# EAGLE design BluePill Breakout v0 (EAGLE 9.5.0)
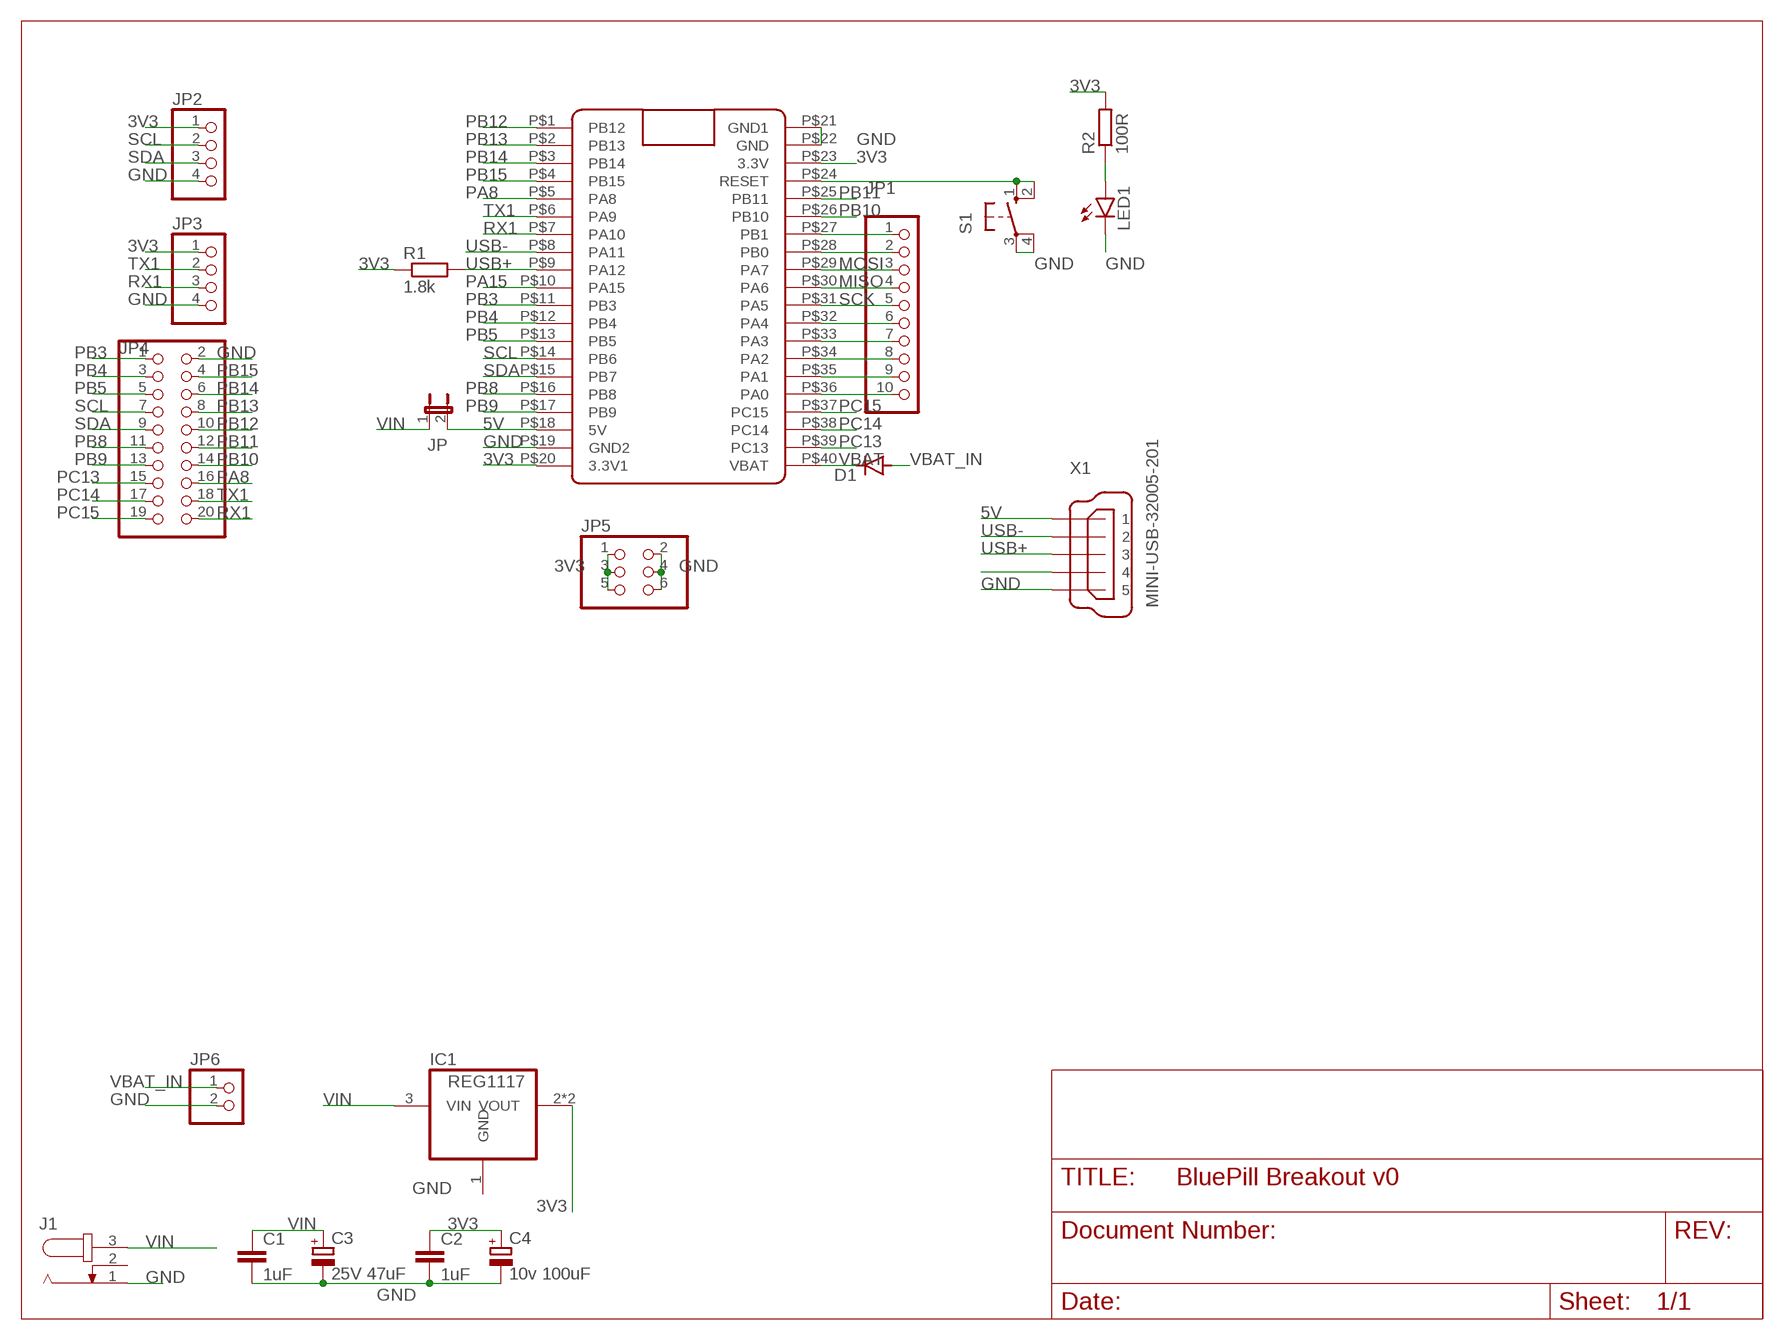
[diagram p0: schematic, sheet 1]

## Parts
C1  1uF  C-EUC0603  [C0603]
C2  1uF  C-EUC0603  [C0603]
C3  25V 47uF  CPOL-EUE2.5-5  [E2,5-5]
C4  10v 100uF  CPOL-EUE2.5-5  [E2,5-5]
D1  DIODE-DO-214AC  [DO-214AC]
IC1  REG1117  [SOT223]
J1  JACK-PLUG0  [SPC4077]
JP  JP1E  [JP1]
JP1  PINHD-1X10  [1X10]
JP2  PINHD-1X4  [1X04]
JP3  PINHD-1X4  [1X04]
JP4  PINHD-2X10  [2X10]
JP5  PINHD-2X3  [2X03]
JP6  PINHD-1X2  [1X02]
LED1  LEDCHIPLED_0603  [CHIPLED_0603]
R1  1.8k  R-EU_R0603  [R0603]
R2  100R  R-EU_R0603  [R0603]
S1  10-XX  [B3F-10XX]
U$1  BLUE_PILL  [BLUE_PILL]
X1  MINI-USB-32005-201  [32005-201]

## Nets
3V3: C2.1 C4.+ IC1.2(VOUT) IC1.4(VOUT) JP2.1 JP3.1 JP5.1 JP5.3 JP5.5 R1.1 R2.2 U$1.P$20(3.3V1) U$1.P$23(3.3V)
5V: JP.2 U$1.P$18(5V) X1.1
GND: C1.2 C2.2 C3.- C4.- J1.1 JP2.4 JP3.4 JP4.2 JP5.2 JP5.4 JP5.6 JP6.2 LED1.C S1.3(P) S1.4(P1) U$1.P$19(GND2) U$1.P$21(GND1) U$1.P$22(GND) X1.5
MISO: JP1.4 U$1.P$30(PA6)
MOSI: JP1.3 U$1.P$29(PA7)
N$3: JP1.10 U$1.P$36(PA0)
N$4: JP1.9 U$1.P$35(PA1)
N$5: JP1.8 U$1.P$34(PA2)
N$6: JP1.7 U$1.P$33(PA3)
N$7: JP1.6 U$1.P$32(PA4)
N$8: S1.1(S) S1.2(S1) U$1.P$24(RESET)
N$9: LED1.A R2.1
N$11: JP1.1 U$1.P$27(PB1)
N$12: JP1.2 U$1.P$28(PB0)
N$15: X1.4
PA8: JP4.16 U$1.P$5(PA8)
PA15: U$1.P$10(PA15)
PB3: JP4.1 U$1.P$11(PB3)
PB4: JP4.3 U$1.P$12(PB4)
PB5: JP4.5 U$1.P$13(PB5)
PB8: JP4.11 U$1.P$16(PB8)
PB9: JP4.13 U$1.P$17(PB9)
PB10: JP4.14 U$1.P$26(PB10)
PB11: JP4.12 U$1.P$25(PB11)
PB12: JP4.10 U$1.P$1(PB12)
PB13: JP4.8 U$1.P$2(PB13)
PB14: JP4.6 U$1.P$3(PB14)
PB15: JP4.4 U$1.P$4(PB15)
PC13: JP4.15 U$1.P$39(PC13)
PC14: JP4.17 U$1.P$38(PC14)
PC15: JP4.19 U$1.P$37(PC15)
RX1: JP3.3 JP4.20 U$1.P$7(PA10)
SCK: JP1.5 U$1.P$31(PA5)
SCL: JP2.2 JP4.7 U$1.P$14(PB6)
SDA: JP2.3 JP4.9 U$1.P$15(PB7)
TX1: JP3.2 JP4.18 U$1.P$6(PA9)
USB+: R1.2 U$1.P$9(PA12) X1.3
USB-: U$1.P$8(PA11) X1.2
VBAT: D1.C U$1.P$40(VBAT)
VBAT_IN: D1.A JP6.1
VIN: C1.1 C3.+ IC1.3(VIN) J1.3 JP.1
Unconnected: J1.2

## Power pins joined to a net without a drawn wire
GND: IC1.1(GND)

## Library data of the parts
C1 C2 = rcl:C-EU: CAPACITOR, European symbol; SPICEPREFIX: C
C3 C4 = rcl:CPOL-EU: POLARIZED CAPACITOR, European symbol; SPICEPREFIX: C
D1 = diode:DIODE-: DIODE
IC1 = Whizz:REG1117: 800mA and 1A Low Dropout (LDO) Positive Regulator 1.8V, 2.5V, 2.85V, 3.3V, 5V, and Adj; MPN: REG1117; OC_FARNELL: 1097566; OC_NEWARK: 14P6981
J1 = con-jack:JACK-PLUG: DC POWER JACK Power Jack, DC, Right Angle, Through Hole, Rated 5A at 16VDC, PC Terminals Distributor: Farnell (www.Farnell.de) Drawing: 84N1161.pdf / 84N1162.pdf Manufacturer: SPC Technology (www.spctechnology.com) Type: SPC4077 / SPC 4078; OC_FARNELL: unknown; OC_NEWARK: unknown
JP = jumper:JP1E: JUMPER
JP1 = pinhead:PINHD-1X10: PIN HEADER
JP2 JP3 = pinhead:PINHD-1X4: PIN HEADER
JP4 = pinhead:PINHD-2X10: PIN HEADER
JP5 = pinhead:PINHD-2X3: PIN HEADER
JP6 = pinhead:PINHD-1X2: PIN HEADER
LED1 = led:LED: LED OSRAM: - CHIPLED LG R971, LG N971, LY N971, LG Q971, LY Q971, LO R971, LY R971 LH N974, LH R974 LS Q976, LO Q976, LY Q976 LO Q996 - Hyper CHIPLED LW Q18S LB Q993, LB Q99A, LB R99A - SideLED LS A670, LO A670, LY A670, LG A670, LP A670 LB A673, LV A673, LT A673, LW A673 LH A674 LY A675 LS A676, LA A676, LO A676, LY A676, LW A676 LS A679, LY A679, LG A679 - Hyper Micro SIDELED® LS Y876, LA Y876, LO Y876, LY Y876 LT Y87S - SmartLED LW L88C, LW L88S LB L89C, LB L89S, LG L890 LS L89K, LO L89K, LY L89K LS L896, LA L896, LO L896, LY L896 - TOPLED LS T670, LO T670, LY T670, LG T670, LP T670 LSG T670, LSP T670, LSY T670, LOP T670, LYG T670 LG T671, LOG T671, LSG T671 LB T673, LV T673, LT T673, LW T673 LH T674 LS T676, LA T676, LO T676, LY T676, LB T676, LH T676, LSB T676, LW T676 LB T67C, LV T67C, LT T67C, LS T67K, LO T67K, LY T67K, LW E67C LS E67B, LA E67B, LO E67B, LY E67B, LB E67C, LV E67C, LT E67C LW T67C LS T679, LY T679, LG T679 LS T770, LO T770, LY T770, LG T770, LP T770 LB T773, LV T773, LT T773, LW T773 LH T774 LS E675, LA E675, LY E675, LS T675 LS T776, LA T776, LO T776, LY T776, LB T776 LHGB T686 LT T68C, LB T68C - Hyper Mini TOPLED® LB M676 - Mini TOPLED Santana® LG M470 LS M47K, LO M47K, LY M47K Source: http://www.osram.convergy.de LUXEON: - LUMILED® LXK2-PW12-R00, LXK2-PW12-S00, LXK2-PW14-U00, LXK2-PW14-V00 LXK2-PM12-R00, LXK2-PM12-S00, LXK2-PM14-U00 LXK2-PE12-Q00, LXK2-PE12-R00, LXK2-PE12-S00, LXK2-PE14-T00, LXK2-PE14-U00 LXK2-PB12-K00, LXK2-PB12-L00, LXK2-PB12-M00, LXK2-PB14-N00, LXK2-PB14-P00, LXK2-PB14-Q00 LXK2-PR12-L00, LXK2-PR12-M00, LXK2-PR14-Q00, LXK2-PR14-R00 LXK2-PD12-Q00, LXK2-PD12-R00, LXK2-PD12-S00 LXK2-PH12-R00, LXK2-PH12-S00 LXK2-PL12-P00, LXK2-PL12-Q00, LXK2-PL12-R00 Source: www.luxeon.com KINGBRIGHT: KA-3528ASYC Source: www.kingbright.com
R1 R2 = rcl:R-EU_: RESISTOR, European symbol; SPICEPREFIX: R
S1 = switch-omron:10-XX: OMRON SWITCH; MPN: B3F-1000; OC_FARNELL: 176432; OC_NEWARK: 36M3542
U$1 = Whizz:BLUE_PILL
X1 = con-cypressindustries:MINI-USB-: MINI USB-B Conector Source: www.cypressindustries.com; OC_FARNELL: unknown; OC_NEWARK: unknown

## Board
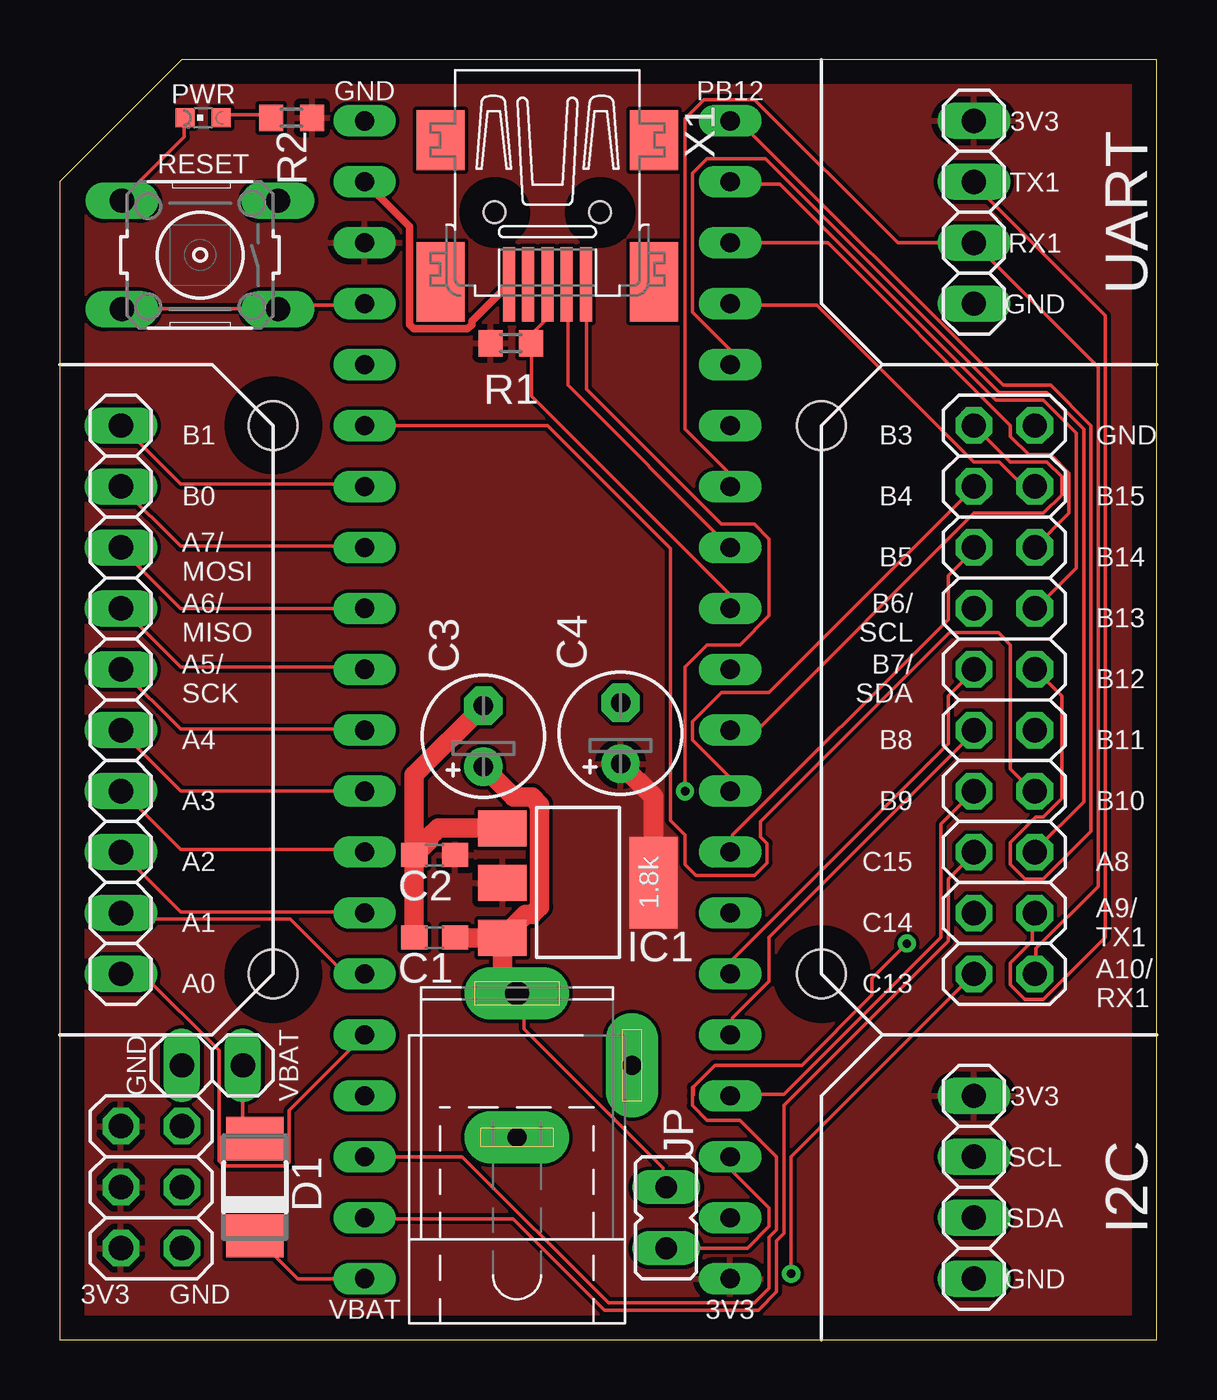
[diagram p1: board, top side]
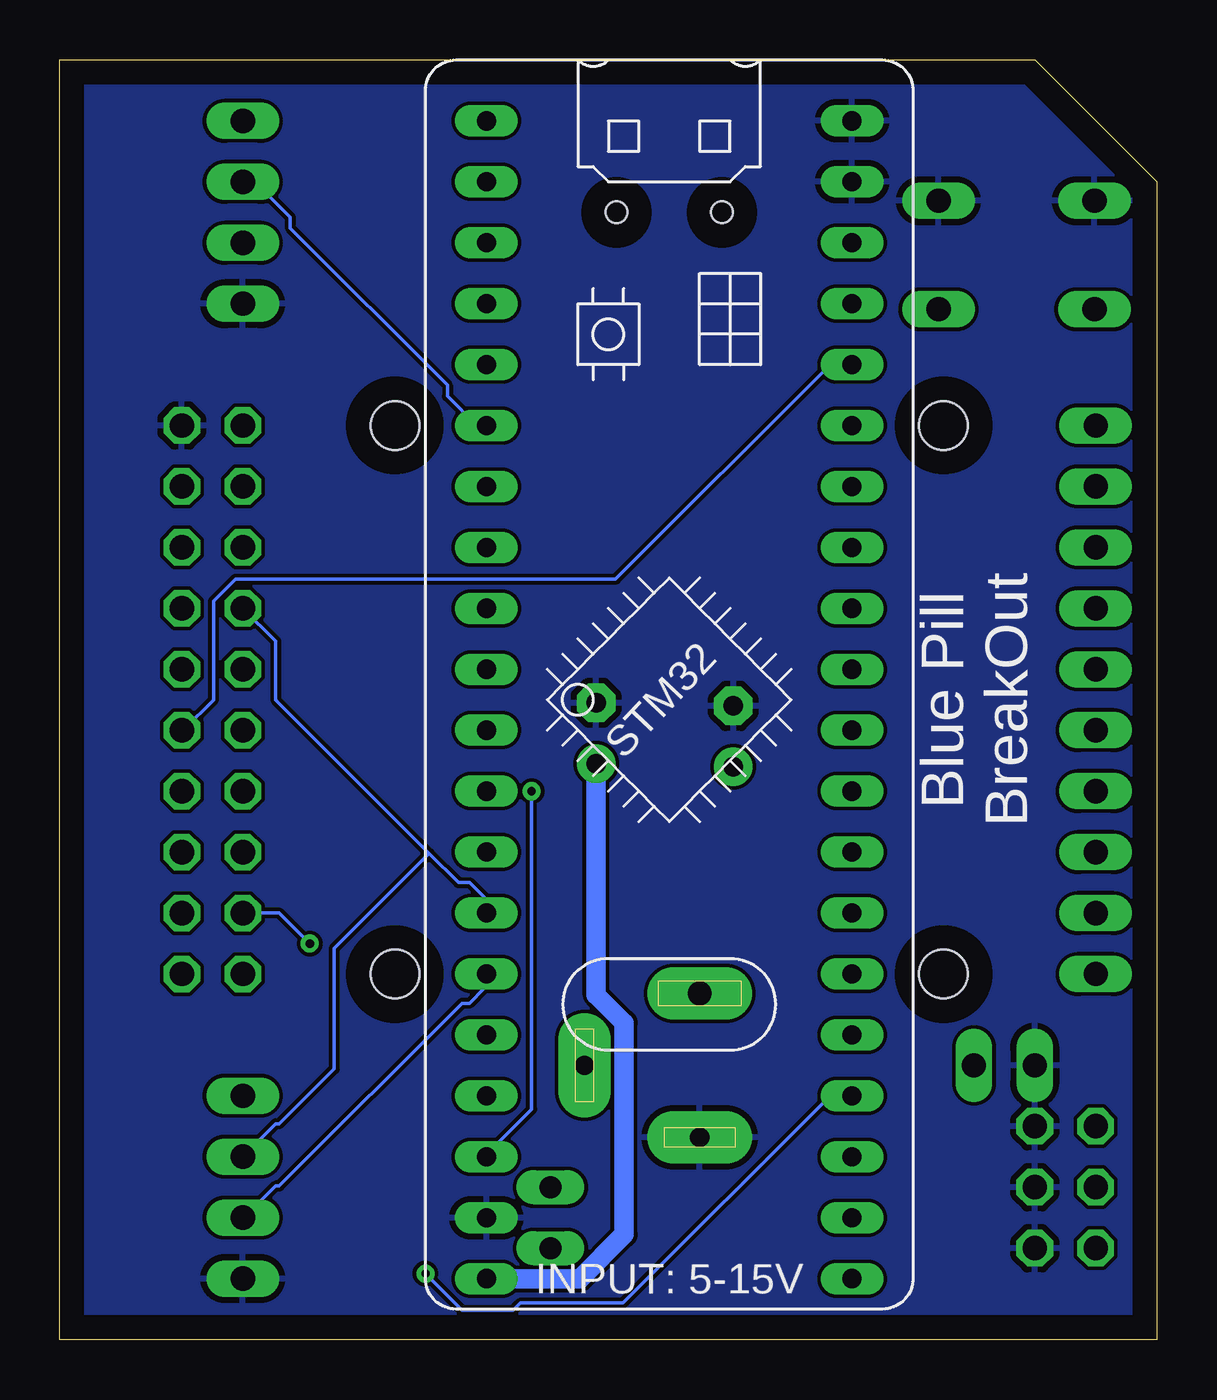
[diagram p2: board, bottom side, seen from below]

Size 45.72 x 53.34 mm. Coordinates in mm from the lower left corner, seen from the top.
Outline: 0,0 45.72,0 45.72,53.34 5.08,53.34 0,48.26 0,0
Copper layers (1*16): Top 0.035mm / dielectric 1.5mm / Bottom 0.035mm
Design rules "default": minimum track width 6mil, minimum drill 0.35mm, track to track 6mil, track to pad 6mil, pad to pad 6mil, via to via 6mil, smd to smd 6mil, copper to edge 40mil, drill to drill 6mil, minimum pad ring 10mil, minimum via ring 8mil, stop-mask expansion 4mil, vias tented up to drill 0mil, thermal gap 10mil
Holes 2.03 mm at 31.75,15.24 8.89,15.24 8.89,38.1 31.75,38.1

### Footprints (pad centres in the part's own frame; a part is rotated, then mirrored left to right if it is on the bottom)
C0603 = smd 1.1 x 1: 1 -0.85,0; 2 0.85,0
E2,5-5 = drill 0.813 pad 1.6: + -1.27,0 | drill 0.813 pad 1.6 octagon: - 1.27,0
DO-214AC = smd 1.8 x 2.4: A 2.025,0; C -2.025,0
SOT223 = smd 1.499 x 2.007: 1 -2.261,-3.15; 2 0.025,-3.15; 3 2.311,-3.15 | smd 3.81 x 2.007: 4 0,3.15
SPC4077 = drill 0.8 pad 2.184 long: 1 -3,0; 2 0,-4.8 | drill 1 pad 2.184 long: 3 3,0
JP1 = drill 0.914 long: 1 0,-1.27; 2 0,1.27
1X10 = drill 1.016 long: 1 -11.43,0; 2 -8.89,0; 3 -6.35,0; 4 -3.81,0; 5 -1.27,0; 6 1.27,0; 7 3.81,0; 8 6.35,0; 9 8.89,0; 10 11.43,0
1X04 = drill 1.016 long: 1 -3.81,0; 2 -1.27,0; 3 1.27,0; 4 3.81,0
2X10 = drill 1.016 octagon: 1 -11.43,-1.27; 2 -11.43,1.27; 3 -8.89,-1.27; 4 -8.89,1.27; 5 -6.35,-1.27; 6 -6.35,1.27; 7 -3.81,-1.27; 8 -3.81,1.27; 9 -1.27,-1.27; 10 -1.27,1.27; 11 1.27,-1.27; 12 1.27,1.27; 13 3.81,-1.27; 14 3.81,1.27; 15 6.35,-1.27; 16 6.35,1.27; 17 8.89,-1.27; 18 8.89,1.27; 19 11.43,-1.27; 20 11.43,1.27
2X03 = drill 1.016 octagon: 1 -2.54,-1.27; 2 -2.54,1.27; 3 0,-1.27; 4 0,1.27; 5 2.54,-1.27; 6 2.54,1.27
1X02 = drill 1.016 long: 1 -1.27,0; 2 1.27,0
CHIPLED_0603 = smd 0.8 x 0.8: A 0,-0.75; C 0,0.75
R0603 = smd 1 x 1.1: 1 -0.85,0; 2 0.85,0
B3F-10XX = drill 1.016 long: 1 -3.251,2.261; 2 3.251,2.261; 3 -3.251,-2.261; 4 3.251,-2.261
BLUE_PILL = drill 0.8 long: P$1 -7.62,15.24; P$2 -7.62,12.7; P$3 -7.62,10.16; P$4 -7.62,7.62; P$5 -7.62,5.08; P$6 -7.62,2.54; P$7 -7.62,0; P$8 -7.62,-2.54; P$9 -7.62,-5.08; P$10 -7.62,-7.62; P$11 -7.62,-10.16; P$12 -7.62,-12.7; P$13 -7.62,-15.24; P$14 -7.62,-17.78; P$15 -7.62,-20.32; P$16 -7.62,-22.86; P$17 -7.62,-25.4; P$18 -7.62,-27.94; P$19 -7.62,-30.48; P$20 -7.62,-33.02; P$21 7.62,15.24; P$22 7.62,12.7; P$23 7.62,10.16; P$24 7.62,7.62; P$25 7.62,5.08; P$26 7.62,2.54; P$27 7.62,0; P$28 7.62,-2.54; P$29 7.62,-5.08; P$30 7.62,-7.62; P$31 7.62,-10.16; P$32 7.62,-12.7; P$33 7.62,-15.24; P$34 7.62,-17.78; P$35 7.62,-20.32; P$36 7.62,-22.86; P$37 7.62,-25.4; P$38 7.62,-27.94; P$39 7.62,-30.48; P$40 7.62,-33.02
32005-201 = smd 3.1 x 0.5: 1 3,1.6; 2 3,0.8; 3 3,0; 4 3,-0.8; 5 3,-1.6 | smd 2.5 x 2: M1 -3,-4.45; M2 -3,4.45 | smd 3.3 x 2: M3 2.9,4.45; M4 2.9,-4.45 | hole 0.9: 0,2.2; 0,-2.2

### Placement (x,y rotation side)
C1  15.62,16.76 180 top
C2  15.62,20.19 180 top
C3  17.65,25.15 90 top
C4  23.37,25.27 90 top
D1  8.13,6.35 90 top
IC1  21.59,19.05 270 top
J1  19.05,11.43 90 top
JP  25.27,5.08 180 top
JP1  2.54,26.67 270 top
JP2  38.1,6.35 270 top
JP3  38.1,46.99 270 top
JP4  39.37,26.67 270 top
JP5  3.81,6.35 270 top
JP6  6.35,11.43 180 top
LED1  5.97,50.93 90 top
R1  18.8,41.53 0 top
R2  9.65,50.93 0 top
S1  5.84,45.21 180 top
U$1  20.32,35.56 0 bottom
X1  20.32,46.99 270 top

### Tracks (layer width: path | path; a pad name or v marks a point on that pad's centre or on a via)
3V3
  Top 0.813: C4.+ 24.74,22.63 IC1.4
  Bottom 0.305: 38.1,9.89 JP2.1
  Bottom 0.813: C4.+ 23.37,14.38 22.2,13.21 22.2,4.38 24.04,2.54 U$1.P$20
  pour Top (rank 6): 0,53.34 0,0 45.72,0 45.72,53.34
  pour Top (no thermals): 26.67,16.51 22.86,16.51 22.86,21.59 26.67,21.59
5V  (via drill 0.35)
  Top 0.152: JP.2 28.65,3.81 29.57,4.72 29.57,5.49 28.04,7.01 28.04,7.62 U$1.P$18 | v26.06,22.86 26.06,28.04 26.98,28.96 28.35,28.96 29.57,30.18 29.57,33.38 28.96,33.98 27.58,33.98 21.95,39.62 21.95,43.89 X1.1
  Bottom 0.152: v26.06,22.86 26.06,9.6 28.04,7.62 U$1.P$18
GND
  Top 0.152: LED1.C 5.18,50.9 5.18,50.14 2.59,47.55 S1.4 | 17.78,21.34 18.44,21.34 IC1.1
  Top 0.305: X1.5 17.18,42.45 17.18,42.31 17,42.13 14.74,42.13 14.56,42.31 14.56,46.4 U$1.P$22
  Top 0.813: C3.- 14.77,23.53 C2.2 | C1.2 C2.2 | C2.2 15.36,20.78 15.36,20.92 15.77,21.34 17.78,21.34
  pour Bottom: 0,53.34 45.72,53.34 45.72,0 0,0
MISO
  Top 0.152: U$1.P$30 12.65,28.04 5.03,28.04 2.59,30.48 JP1.4
MOSI
  Top 0.152: U$1.P$29 5.03,30.48 2.59,32.92 JP1.3
N$3
  Top 0.152: 12.65,12.8 U$1.P$36 9.56,9.56 9.56,7.38 9.42,7.25 6.83,7.25 6.63,7.45 6.63,12.04 3.43,15.24 JP1.10 2.59,15.24
N$4
  Top 0.152: U$1.P$35 11.89,15.24 9.6,17.53 2.74,17.53 2.59,17.68 JP1.9
N$5
  Top 0.152: JP1.8 5.03,17.83 12.65,17.83 U$1.P$34
N$6
  Top 0.152: U$1.P$33 12.65,20.42 5.03,20.42 2.59,22.86 JP1.7
N$7
  Top 0.152: U$1.P$32 5.03,22.86 2.59,25.3 JP1.6
N$8
  Top 0.152: U$1.P$24 12.65,43.13 9.3,43.13 9.14,42.98 S1.1 8.99,42.98 2.59,42.98 S1.2
N$9
  Top 0.152: LED1.A 6.86,51.05 8.71,51.05 R2.1
N$11
  Top 0.152: U$1.P$27 12.65,35.66 5.03,35.66 2.59,38.1 JP1.1
N$12
  Top 0.152: JP1.2 5.03,33.07 12.65,33.07 U$1.P$28
PA8
  Top 0.152: U$1.P$5 27.89,40.69 27.89,41.3 26.36,42.82 26.36,48.62 26.98,49.23 29.41,49.23 39.17,39.47 41.15,39.47 42.67,37.95 42.67,22.4 40.69,20.42 JP4.16
PB3
  Top 0.152: JP4.1 39.62,36.58 41.15,36.58 41.76,35.97 41.76,35.2 41,34.44 38.1,34.44 29.11,25.45 28.04,25.45 U$1.P$11
PB4
  Top 0.152: U$1.P$12 27.89,22.86 27.89,23.47 26.36,24.99 26.36,25.76 27.58,26.98 29.57,26.98 38.1,35.51 JP4.3
PB5
  Top 0.152: U$1.P$13 28.04,20.42 28.04,21.03 37.03,30.02 37.03,31.85 38.1,32.92 JP4.5
PB8
  Top 0.152: U$1.P$16 28.04,12.8 28.04,13.41 29.57,14.94 29.57,16.76 38.1,25.3 JP4.11
PB9
  Top 0.152: JP4.13 36.73,21.49 36.73,16.76 30.18,10.21 28.04,10.21 U$1.P$17
PB10
  Top 0.152: JP4.14 40.54,22.86 39.62,23.77 39.62,28.96 39.12,29.46 37.08,29.46 29.21,21.59 29.21,20.95 29.48,20.69 29.48,19.88 28.96,19.36 26.52,19.36 26.06,19.81 26.06,21.03 25.45,21.64 25.45,32.97 20.32,38.1 U$1.P$26
PB11
  Bottom 0.152: U$1.P$25 12.8,40.54 13.72,40.54 22.55,31.7 38.41,31.7 39.32,30.79 39.32,26.67 40.54,25.45 JP4.12
PB12
  Top 0.152: JP4.10 41.76,26.82 41.76,22.55 41,21.79 40.69,21.79 39.62,20.73 39.62,19.81 40.23,19.2 41,19.2 42.98,21.18 42.98,38.1 41.3,39.78 39.32,39.78 28.35,50.75 28.04,50.75 U$1.P$1
PB13
  Top 0.152: U$1.P$2 28.04,48.16 30.02,48.16 39.01,39.17 41,39.17 42.37,37.8 42.37,32.16 40.69,30.48 JP4.8
PB14
  Top 0.152: U$1.P$3 32,45.72 39.62,38.1 39.62,37.64 40.39,36.88 41.3,36.88 42.06,36.12 42.06,34.44 JP4.6
PB15
  Top 0.152: U$1.P$4 28.04,43.13 31.55,43.13 38.1,36.58 39.17,36.58 40.08,35.66 40.54,35.66 JP4.4
PC13
  Top 0.152: U$1.P$39 12.8,5.03 18.9,5.03 22.71,1.22 29.11,1.22 29.87,1.98 29.87,4.12 30.18,4.42 30.18,9.75 37.03,16.61 37.03,19.2 38.1,20.27 JP4.15
PC14  (via drill 0.35)
  Top 0.152: U$1.P$38 16.76,7.62 22.86,1.52 28.96,1.52 29.57,2.13 29.57,4.27 29.87,4.57 29.87,7.62 28.35,9.14 26.98,9.14 26.36,9.75 26.36,10.16 | 26.36,10.52 26.36,10.16 | 26.36,10.16 26.4,10.2 26.4,10.53 27.31,11.43 30.92,11.43 33.86,14.37 33.86,15.06 v35.31,16.51
  Bottom 0.152: v35.31,16.51 36.58,17.78 JP4.17
PC15  (via drill 0.35)
  Top 0.152: v30.48,2.74 30.48,7.62 JP4.19
  Bottom 0.152: v30.48,2.74 28.96,1.22 26.82,1.22 26.52,1.52 22.25,1.52 13.72,10.06 12.8,10.06 U$1.P$37
RX1
  Top 0.152: U$1.P$7 27.89,35.66 27.89,36.12 26.06,37.95 26.06,50.9 26.85,51.69 28.96,51.69 34.92,45.72 JP3.3 43.28,40.54 43.28,18.9 40.69,16.31 40.69,15.24 JP4.20
SCK
  Top 0.152: JP1.5 5.03,25.45 12.65,25.45 U$1.P$31
SCL
  Bottom 0.152: 30.33,20.27 36.73,26.67 36.73,29.11 JP4.7 | 30.33,20.27 29.11,19.05 28.65,19.05 28.04,18.44 28.04,17.83 U$1.P$14 | JP2.2 36.73,8.99 36.58,8.99 34.29,11.28 34.29,16.31 30.33,20.27
SDA
  Top 0.152: U$1.P$15 28.04,15.24 28.04,15.85 37.03,24.84 37.03,26.82 38.1,27.89 JP4.9
  Bottom 0.152: JP2.3 38.1,5.18 37.64,5.64 37.49,5.64 36.73,6.4 36.58,6.4 28.96,14.02 28.65,14.02 28.04,14.63 28.04,15.24 U$1.P$15
TX1
  Top 0.152: JP4.18 40.54,17.68 40.54,16.61 39.62,15.7 39.62,14.78 40.23,14.17 41,14.17 43.59,16.76 43.59,42.67 38.1,48.16 JP3.2
  Bottom 0.152: U$1.P$6 28.35,38.1 29.57,39.32 29.57,39.78 36.12,46.33 36.12,46.79 37.49,48.16 38.1,48.16 JP3.2
USB+
  Top 0.152: X1.3 20.27,43.89 20.27,42.52 19.66,41.91 19.66,41.6 R1.2 19.66,41.45 19.66,39.32 27.89,31.09 27.89,30.48 U$1.P$9
USB-
  Top 0.152: U$1.P$8 21.18,39.78 21.18,43.89 X1.2
VBAT
  Top 0.152: D1.C 9.91,2.54 U$1.P$40
VBAT_IN
  Top 0.152: D1.A 7.62,8.88 JP6.1
VIN
  Top 0.152: JP.1 25.15,6.4 25.15,7.16 19.36,12.95 19.36,14.17 J1.3
  Top 0.813: J1.3 18.44,15.04 IC1.3 | IC1.3 16.5,16.74 C1.1 | IC1.3 19.42,17.72 19.68,17.72 20,18.04 20,22.29 19.68,22.62 18.91,22.62 C3.+

### Text on the board
tPlace: PWR | GND | PB12 | 3V3 | RESET | TX1 | UART | RX1 | GND | B1 | B3 | GND | B0 | B4 | B15 | A7/ / MOSI | B5 | B14 | A6/ / MISO | B6/ / SCL | B13 | A5/ / SCK | B7/ / SDA | B12 | A4 | B8 | B11 | A3 | B9 | B10 | A2 | C15 | A8 | 1.8k | A1 | C14 | A9/ / TX1 | A0 | C13 | A10/ / RX1 | GND | VBAT | 3V3 | SCL | I2C | SDA | GND | 3V3 | GND | VBAT | 3V3
bPlace: Blue Pill / BreakOut | INPUT: 5-15V